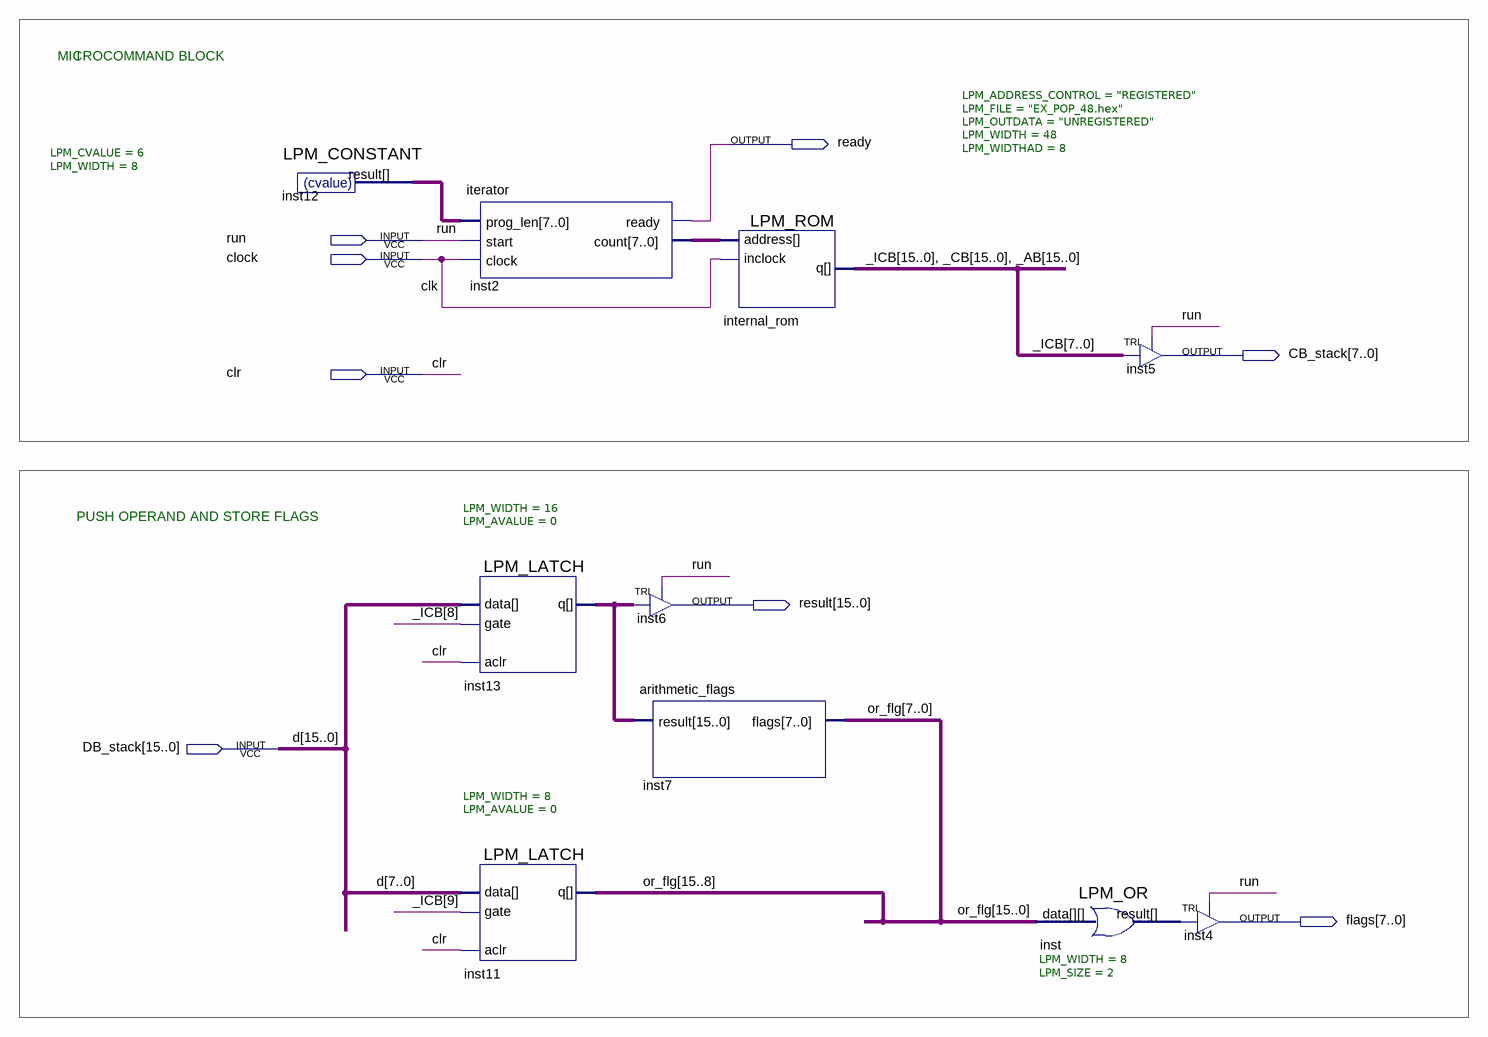
[diagram p0: schematic sheet]
// Quartus schematic EX_POP.bdf as structural Verilog: 10 symbols, 8 pins
module EX_POP (
  input  run,
  input  clock,
  input  clr,
  input  [15:0] DB_stack,
  output ready,
  output [7:0] CB_stack,
  output [15:0] result,
  output [7:0] flags
);

  wire [7:0] inst2_count, inst12_result, inst_result;
  wire [15:0] _AB, _CB, _ICB, inst13_q, or_flg;

  LPM_CONSTANT #(.LPM_CVALUE(6), .LPM_WIDTH(8)) inst12 (.result(inst12_result));
  iterator inst2 (.prog_len(inst12_result), .start(run), .clock(clock), .ready(ready), .count(inst2_count));
  LPM_LATCH #(.LPM_WIDTH(16), .LPM_AVALUE(0)) inst13 (.aclr(clr), .data(DB_stack), .gate(_ICB[8]), .q(inst13_q));
  LPM_LATCH #(.LPM_WIDTH(8), .LPM_AVALUE(0)) inst11 (
    .aclr(clr), .data(DB_stack[7:0]), .gate(_ICB[9]), .q(or_flg[15:8]));
  TRI inst6[15:0] (.IN(inst13_q), .OE(run), .OUT(result));
  arithmetic_flags inst7 (.result(inst13_q), .flags(or_flg[7:0]));
  LPM_ROM #(.LPM_ADDRESS_CONTROL("REGISTERED"), .LPM_FILE("EX_POP_48.hex"), .LPM_OUTDATA("UNREGISTERED"), .LPM_WIDTH(48), .LPM_WIDTHAD(8)) internal_rom (
    .address(inst2_count), .inclock(clock), .q({_ICB, _CB, _AB}));
  LPM_OR #(.LPM_WIDTH(8), .LPM_SIZE(2)) inst (.data(or_flg), .result(inst_result));
  TRI inst5[7:0] (.IN(_ICB[7:0]), .OE(run), .OUT(CB_stack));
  TRI inst4[7:0] (.IN(inst_result), .OE(run), .OUT(flags));

  // Other names for the same wires on the sheet: clk = clock; d[15:0] = DB_stack

  // Notes on the sheet:
  //   MICROCOMMAND BLOCK
  //   I
  //   PUSH OPERAND AND STORE FLAGS
endmodule
